# EAGLE design SBCONN (EAGLE 9.6.2)
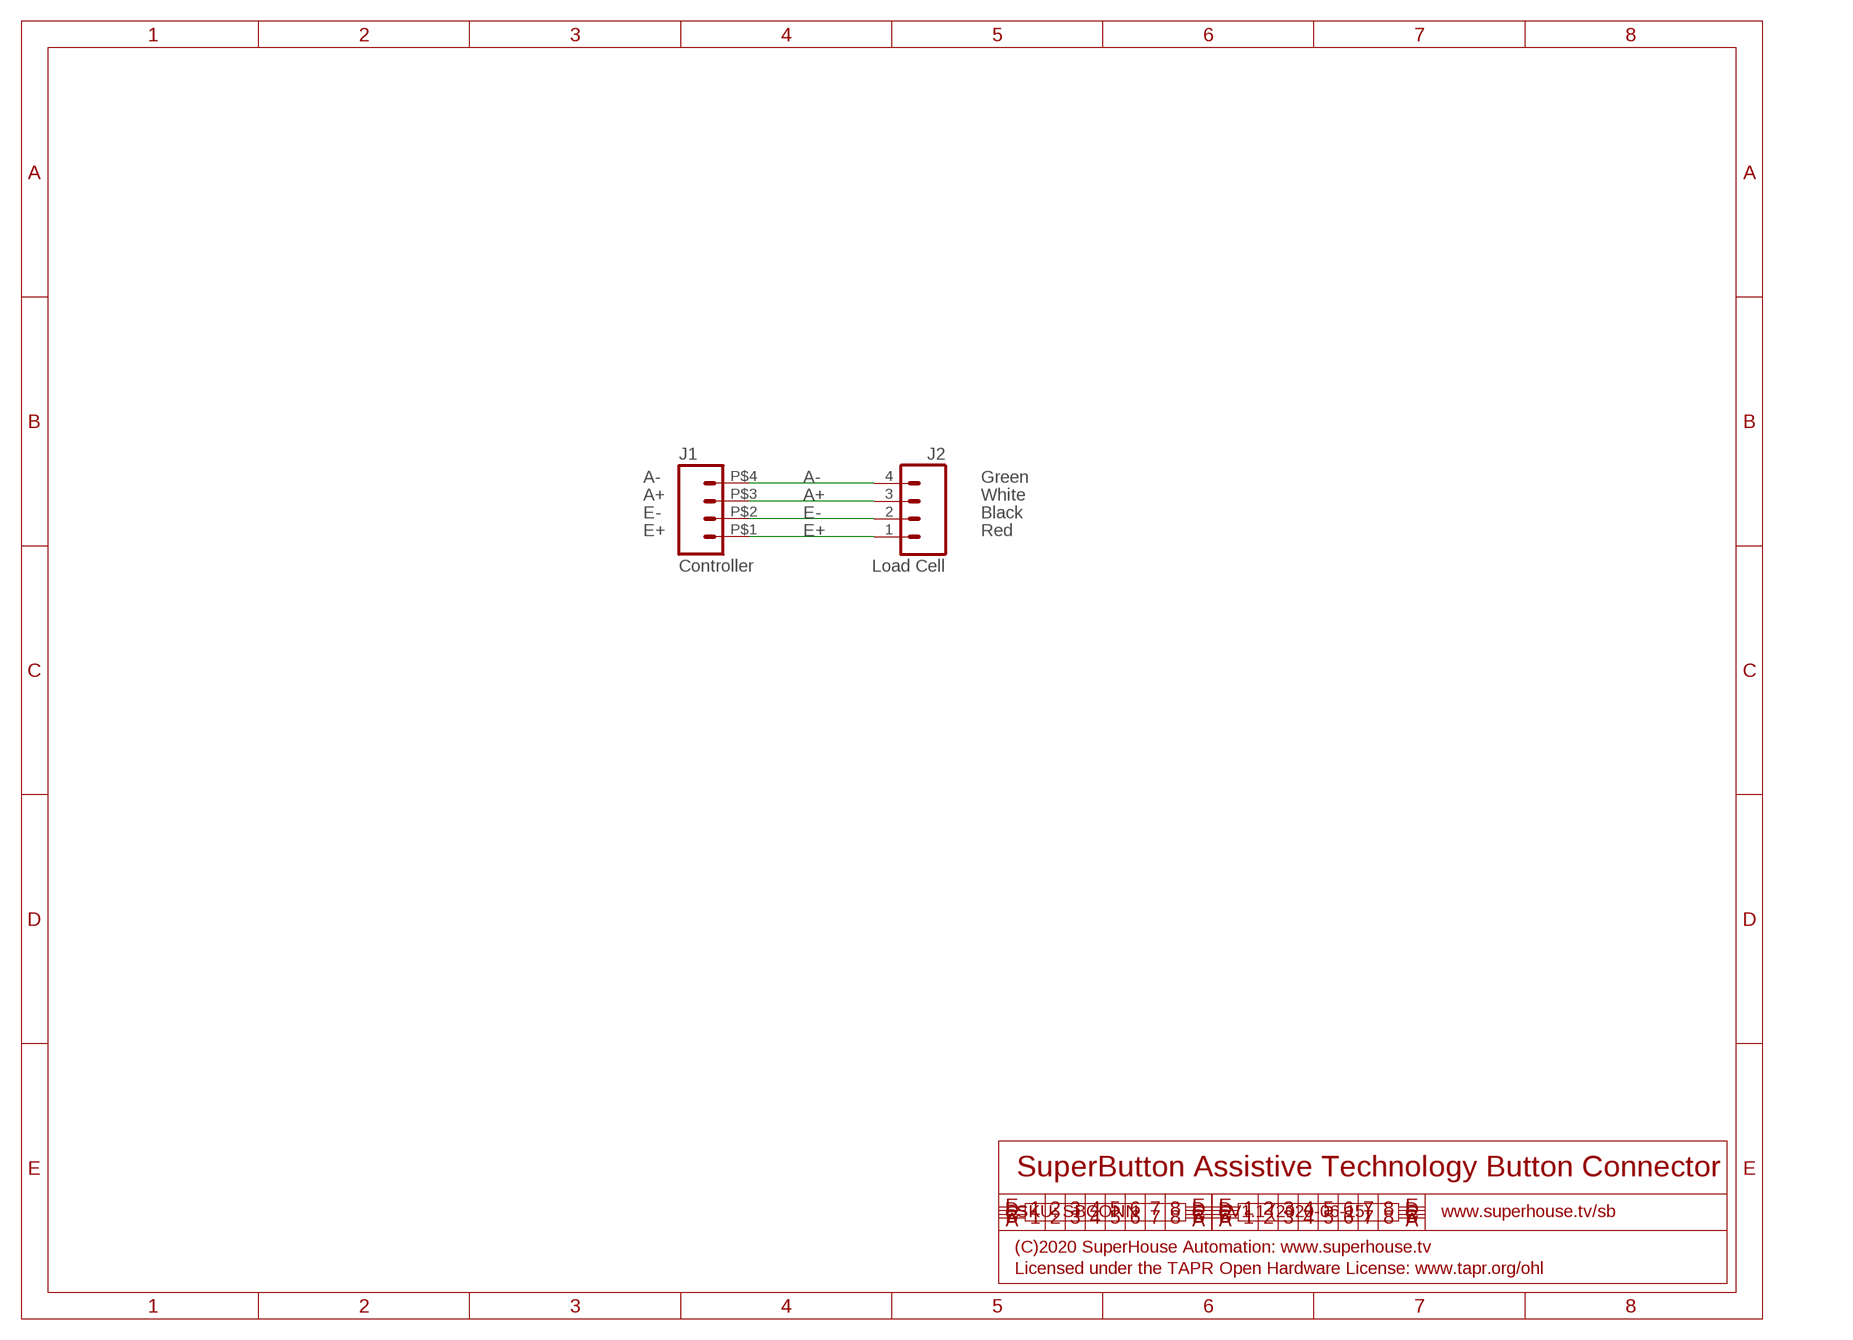
[diagram p0: schematic, sheet 1]

## Parts
J1  Controller  RJ10-WURTH  [RJ10]
J2  Load Cell  M04-1.27-PLAIN  [1X04-1.27-PLAIN]

## Nets
A+: J1.P$3 J2.3
A-: J1.P$4 J2.4
E+: J1.P$1 J2.1
E-: J1.P$2 J2.2

## Notes on the sheet
- A- | Green
- A+ | White
- E- | Black
- E+ | Red
- SuperButton Assistive Technology Button Connector
- SKU: SBCONN | V1.1 (2020-06-15) | www.superhouse.tv/sb
- (C)2020 SuperHouse Automation: www.superhouse.tv
- Licensed under the TAPR Open Hardware License: www.tapr.org/ohl

## Library data of the parts
J1 = SuperHouse-Connectors:RJ10: RJ10 jack (4P4C)
J2 = SuperHouse-Connectors:M04: 4-way header Standard 1x4 header, and screw terminal variations

## Board
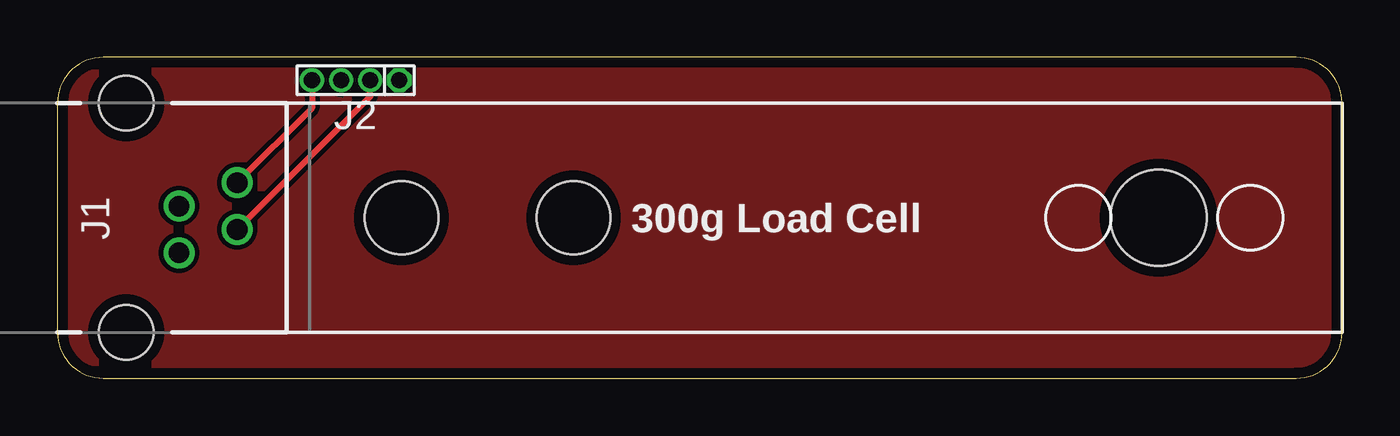
[diagram p1: board, top side]
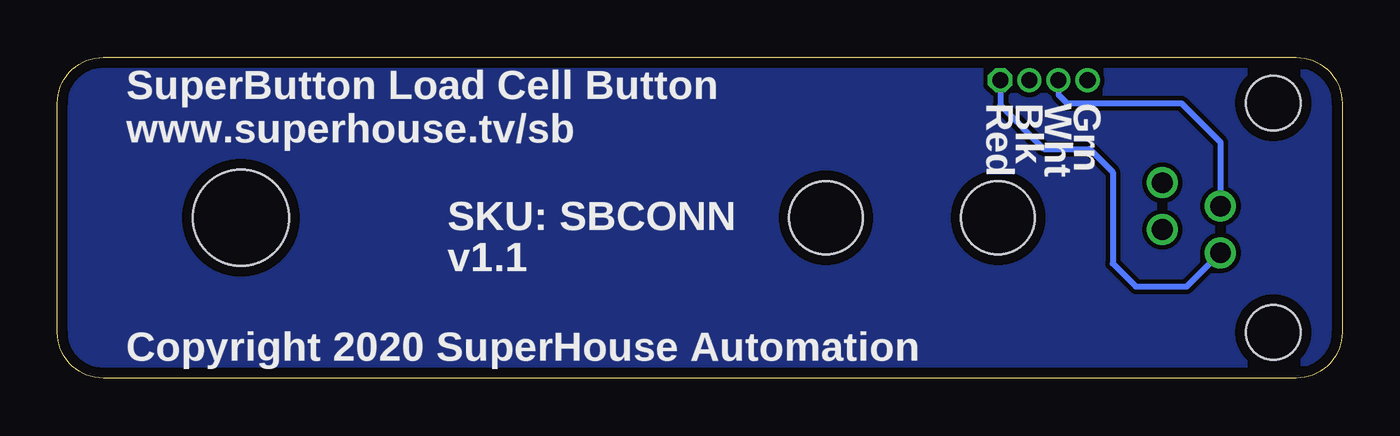
[diagram p2: board, bottom side, seen from below]

Size 56 x 14 mm. Coordinates in mm from the lower left corner, seen from the top.
Outline: 54,14 2,14 arc90 0,12 0,2 arc90 2,0 54,0 arc90 56,2 56,12 arc90 54,14
Copper layers (1*16): Top 0.035mm / dielectric 1.5mm / Bottom 0.035mm
Design rules "SuperHouse-Design-Rules": minimum track width 10mil, minimum drill 24mil, track to track 8mil, track to pad 8mil, pad to pad 8mil, via to via 8mil, smd to smd 6mil, copper to edge 18mil, drill to drill 8mil, minimum pad ring 7mil, minimum via ring 8mil, stop-mask expansion 4mil, vias tented up to drill 0.5mm, thermal gap 10mil
Holes 3.2 mm at 15,7 22.5,7
Holes 4.2 mm at 48,7

### Footprints (pad centres in the part's own frame; a part is rotated, then mirrored left to right if it is on the bottom)
RJ10 = drill 0.9: P$1 1.53,2.3; P$2 0.51,4.84; P$3 -0.51,2.3; P$4 -1.53,4.84 | hole 2.4: -5,0; 5,0
1X04-1.27-PLAIN = drill 0.7 pad 1.016 octagon: 1 -1.905,0 | drill 0.7 pad 1.016: 2 -0.635,0; 3 0.635,0; 4 1.905,0

### Placement (x,y rotation side)
J1  3,7 270 top
J2  13,13 180 top

### Tracks (layer width: path | path; a pad name or v marks a point on that pad's centre or on a via)
5V
  pour Bottom: 54,0 2,0 arc-90 0,2 0,12 arc-90 2,14 54,14 arc-90 56,12 56,2 arc-90
A+
  Bottom 0.254: J2.3 12.37,12.37 12,12 7,12 5.3,10.3 J1.P$3
A-
  Top 0.254: J2.4 11.1,11.79 J1.P$4
E+
  Bottom 0.254: J2.1 14.9,11.9 13,10 11,10 10,9 10,5 9,4 6.77,4 J1.P$1
E-
  Top 0.254: J1.P$2 13.63,12.29 J2.2
GND
  pour Top: 54,0 2,0 arc-90 0,2 0,12 arc-90 2,14 54,14 arc-90 56,12 56,2 arc-90

### Text on the board
tPlace: 300g Load Cell
bPlace: Grn | Wht | Blk | Red | SKU: SBCONN | SuperButton Load Cell Button / www.superhouse.tv/sb / / / / / Copyright 2020 SuperHouse Automation | v1.1